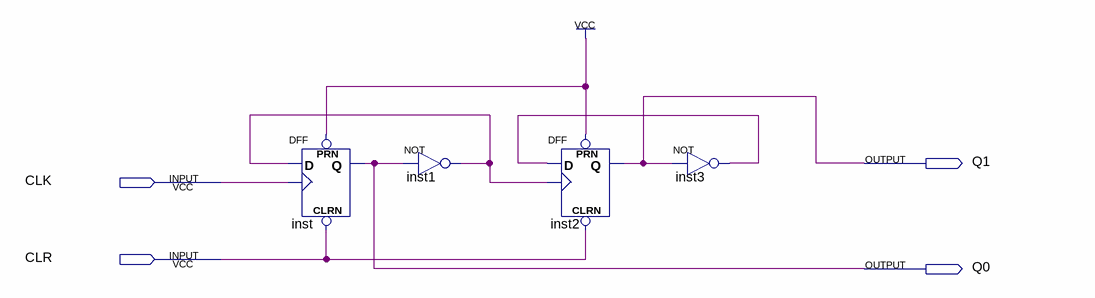
[diagram p0: schematic sheet]
// Quartus schematic mod4plus1.bdf as structural Verilog: 4 symbols, 4 pins
module mod4plus1 (
  input  CLK,
  input  CLR,
  output Q1,
  output Q0
);

  wire inst1_out, inst3_out;

  DFF inst (.CLRN(CLR), .CLK(CLK), .D(inst1_out), .PRN(1'b1), .Q(Q0));
  not inst1 (inst1_out, Q0);
  DFF inst2 (.CLRN(CLR), .CLK(inst1_out), .D(inst3_out), .PRN(1'b1), .Q(Q1));
  not inst3 (inst3_out, Q1);
endmodule
